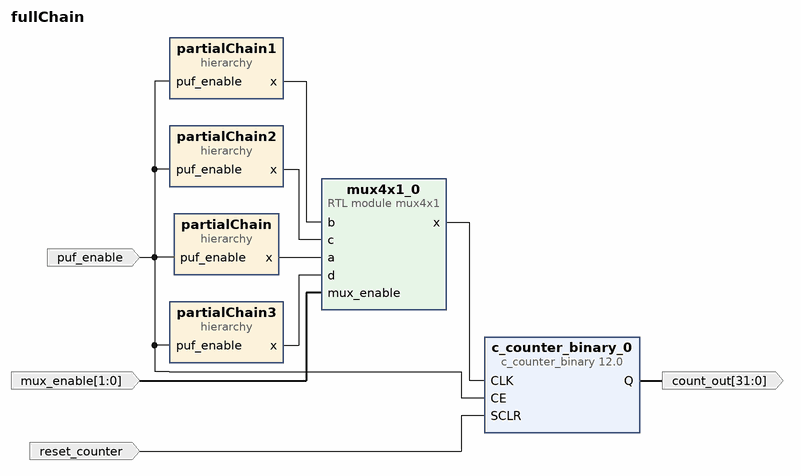
[diagram p0: block diagram of the top level]
# Vivado block design fullChain, xc7z020clg484-1, Vivado 2024.2
create_bd_design fullChain

create_bd_port -dir I puf_enable
create_bd_port -dir O -from 31 -to 0 count_out
create_bd_port -dir I -type data reset_counter
create_bd_port -dir I -from 1 -to 0 mux_enable

create_bd_cell -type hier partialChain
create_bd_cell -type hier partialChain1
create_bd_cell -type hier partialChain2
create_bd_cell -type hier partialChain3
create_bd_cell -type ip -vlnv xilinx.com:ip:c_counter_binary:12.0 c_counter_binary_0
set_property -dict [list \
  CONFIG.CE true \
  CONFIG.Fb_Latency_Configuration Automatic \
  CONFIG.Implementation DSP48 \
  CONFIG.Latency_Configuration Automatic \
  CONFIG.Load false \
  CONFIG.Output_Width 32 \
  CONFIG.Restrict_Count false \
  CONFIG.SCLR true \
] [get_bd_cells c_counter_binary_0]
create_bd_cell -type module -reference mux4x1 mux4x1_0

# ---- hierarchy /partialChain ----
current_bd_instance /partialChain
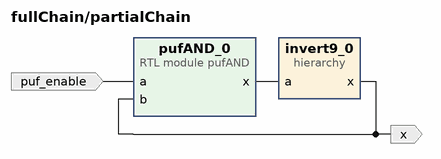
[diagram p1: block diagram inside /partialChain]
create_bd_pin -dir O x
create_bd_pin -dir I puf_enable

create_bd_cell -type hier invert9_0
create_bd_cell -type module -reference pufAND pufAND_0

# ---- hierarchy /partialChain/invert9_0 ----
current_bd_instance /partialChain/invert9_0
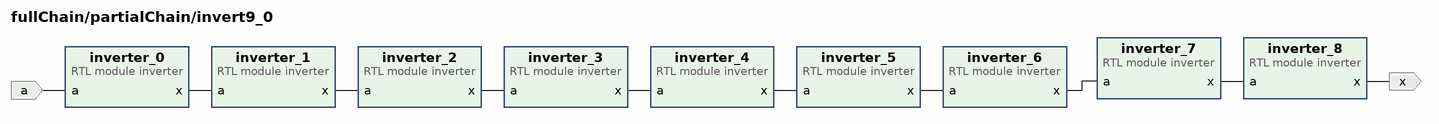
[diagram p2: block diagram inside /partialChain/invert9_0]
create_bd_pin -dir O x
create_bd_pin -dir I a

create_bd_cell -type module -reference inverter inverter_0
create_bd_cell -type module -reference inverter inverter_1
create_bd_cell -type module -reference inverter inverter_2
create_bd_cell -type module -reference inverter inverter_5
create_bd_cell -type module -reference inverter inverter_4
create_bd_cell -type module -reference inverter inverter_3
create_bd_cell -type module -reference inverter inverter_7
create_bd_cell -type module -reference inverter inverter_8
create_bd_cell -type module -reference inverter inverter_6

# ---- hierarchy /partialChain1 ----
current_bd_instance /partialChain1
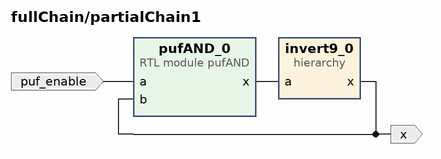
[diagram p3: block diagram inside /partialChain1]
create_bd_pin -dir O x
create_bd_pin -dir I puf_enable

create_bd_cell -type hier invert9_0
create_bd_cell -type module -reference pufAND pufAND_0

# ---- hierarchy /partialChain1/invert9_0 ----
current_bd_instance /partialChain1/invert9_0
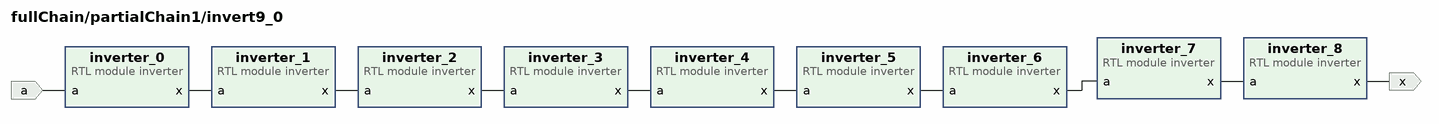
[diagram p4: block diagram inside /partialChain1/invert9_0]
create_bd_pin -dir O x
create_bd_pin -dir I a

create_bd_cell -type module -reference inverter inverter_0
create_bd_cell -type module -reference inverter inverter_1
create_bd_cell -type module -reference inverter inverter_2
create_bd_cell -type module -reference inverter inverter_5
create_bd_cell -type module -reference inverter inverter_4
create_bd_cell -type module -reference inverter inverter_3
create_bd_cell -type module -reference inverter inverter_7
create_bd_cell -type module -reference inverter inverter_8
create_bd_cell -type module -reference inverter inverter_6

# ---- hierarchy /partialChain2 ----
current_bd_instance /partialChain2
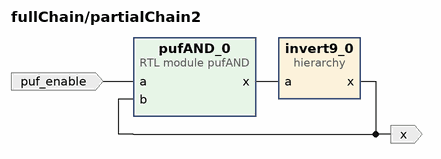
[diagram p5: block diagram inside /partialChain2]
create_bd_pin -dir O x
create_bd_pin -dir I puf_enable

create_bd_cell -type hier invert9_0
create_bd_cell -type module -reference pufAND pufAND_0

# ---- hierarchy /partialChain2/invert9_0 ----
current_bd_instance /partialChain2/invert9_0
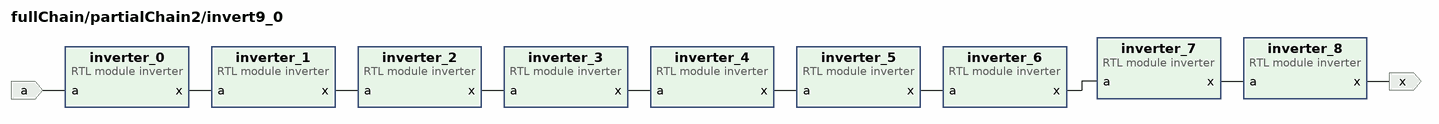
[diagram p6: block diagram inside /partialChain2/invert9_0]
create_bd_pin -dir O x
create_bd_pin -dir I a

create_bd_cell -type module -reference inverter inverter_0
create_bd_cell -type module -reference inverter inverter_1
create_bd_cell -type module -reference inverter inverter_2
create_bd_cell -type module -reference inverter inverter_5
create_bd_cell -type module -reference inverter inverter_4
create_bd_cell -type module -reference inverter inverter_3
create_bd_cell -type module -reference inverter inverter_7
create_bd_cell -type module -reference inverter inverter_8
create_bd_cell -type module -reference inverter inverter_6

# ---- hierarchy /partialChain3 ----
current_bd_instance /partialChain3
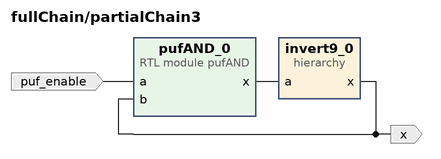
[diagram p7: block diagram inside /partialChain3]
create_bd_pin -dir O x
create_bd_pin -dir I puf_enable

create_bd_cell -type hier invert9_0
create_bd_cell -type module -reference pufAND pufAND_0

# ---- hierarchy /partialChain3/invert9_0 ----
current_bd_instance /partialChain3/invert9_0
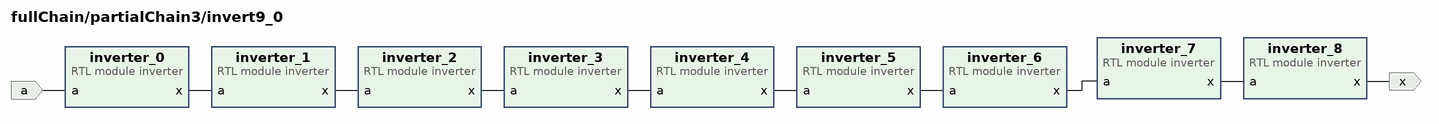
[diagram p8: block diagram inside /partialChain3/invert9_0]
create_bd_pin -dir O x
create_bd_pin -dir I a

create_bd_cell -type module -reference inverter inverter_0
create_bd_cell -type module -reference inverter inverter_1
create_bd_cell -type module -reference inverter inverter_2
create_bd_cell -type module -reference inverter inverter_5
create_bd_cell -type module -reference inverter inverter_4
create_bd_cell -type module -reference inverter inverter_3
create_bd_cell -type module -reference inverter inverter_7
create_bd_cell -type module -reference inverter inverter_8
create_bd_cell -type module -reference inverter inverter_6

# ---- connections ----

current_bd_instance /partialChain
connect_bd_net [get_bd_pins invert9_0/x] [get_bd_pins x] [get_bd_pins pufAND_0/b]
connect_bd_net [get_bd_pins pufAND_0/x] [get_bd_pins invert9_0/a]
connect_bd_net -net puf_CLK_1 [get_bd_pins puf_enable] [get_bd_pins pufAND_0/a]

current_bd_instance /partialChain/invert9_0
connect_bd_net [get_bd_pins a] [get_bd_pins inverter_0/a]
connect_bd_net [get_bd_pins inverter_0/x] [get_bd_pins inverter_1/a]
connect_bd_net -net inverter_2_x [get_bd_pins inverter_8/x] [get_bd_pins x]
connect_bd_net [get_bd_pins inverter_3/x] [get_bd_pins inverter_4/a]
connect_bd_net -net inverter_5_x [get_bd_pins inverter_4/x] [get_bd_pins inverter_5/a]
connect_bd_net -net inverter_6_x [get_bd_pins inverter_2/x] [get_bd_pins inverter_3/a]
connect_bd_net -net inverter_7_x [get_bd_pins inverter_5/x] [get_bd_pins inverter_6/a]
connect_bd_net [get_bd_pins inverter_7/x] [get_bd_pins inverter_8/a]
connect_bd_net -net inverter_8_x [get_bd_pins inverter_6/x] [get_bd_pins inverter_7/a]
connect_bd_net -net inverter_9_x [get_bd_pins inverter_1/x] [get_bd_pins inverter_2/a]

current_bd_instance /partialChain1
connect_bd_net [get_bd_pins invert9_0/x] [get_bd_pins x] [get_bd_pins pufAND_0/b]
connect_bd_net [get_bd_pins pufAND_0/x] [get_bd_pins invert9_0/a]
connect_bd_net -net puf_CLK_1 [get_bd_pins puf_enable] [get_bd_pins pufAND_0/a]

current_bd_instance /partialChain1/invert9_0
connect_bd_net [get_bd_pins a] [get_bd_pins inverter_0/a]
connect_bd_net [get_bd_pins inverter_0/x] [get_bd_pins inverter_1/a]
connect_bd_net -net inverter_2_x [get_bd_pins inverter_8/x] [get_bd_pins x]
connect_bd_net [get_bd_pins inverter_3/x] [get_bd_pins inverter_4/a]
connect_bd_net -net inverter_4_x [get_bd_pins inverter_7/x] [get_bd_pins inverter_8/a]
connect_bd_net -net inverter_5_x [get_bd_pins inverter_4/x] [get_bd_pins inverter_5/a]
connect_bd_net -net inverter_6_x [get_bd_pins inverter_2/x] [get_bd_pins inverter_3/a]
connect_bd_net -net inverter_7_x [get_bd_pins inverter_5/x] [get_bd_pins inverter_6/a]
connect_bd_net -net inverter_8_x [get_bd_pins inverter_6/x] [get_bd_pins inverter_7/a]
connect_bd_net -net inverter_9_x [get_bd_pins inverter_1/x] [get_bd_pins inverter_2/a]

current_bd_instance /partialChain2
connect_bd_net -net a_1 [get_bd_pins pufAND_0/x] [get_bd_pins invert9_0/a]
connect_bd_net [get_bd_pins invert9_0/x] [get_bd_pins x] [get_bd_pins pufAND_0/b]
connect_bd_net -net puf_CLK_1 [get_bd_pins puf_enable] [get_bd_pins pufAND_0/a]

current_bd_instance /partialChain2/invert9_0
connect_bd_net [get_bd_pins a] [get_bd_pins inverter_0/a]
connect_bd_net [get_bd_pins inverter_0/x] [get_bd_pins inverter_1/a]
connect_bd_net -net inverter_2_x [get_bd_pins inverter_8/x] [get_bd_pins x]
connect_bd_net [get_bd_pins inverter_3/x] [get_bd_pins inverter_4/a]
connect_bd_net -net inverter_4_x [get_bd_pins inverter_7/x] [get_bd_pins inverter_8/a]
connect_bd_net -net inverter_5_x [get_bd_pins inverter_4/x] [get_bd_pins inverter_5/a]
connect_bd_net -net inverter_6_x [get_bd_pins inverter_2/x] [get_bd_pins inverter_3/a]
connect_bd_net -net inverter_7_x [get_bd_pins inverter_5/x] [get_bd_pins inverter_6/a]
connect_bd_net -net inverter_8_x [get_bd_pins inverter_6/x] [get_bd_pins inverter_7/a]
connect_bd_net -net inverter_9_x [get_bd_pins inverter_1/x] [get_bd_pins inverter_2/a]

current_bd_instance /partialChain3
connect_bd_net -net a_1 [get_bd_pins pufAND_0/x] [get_bd_pins invert9_0/a]
connect_bd_net [get_bd_pins invert9_0/x] [get_bd_pins x] [get_bd_pins pufAND_0/b]
connect_bd_net -net puf_CLK_1 [get_bd_pins puf_enable] [get_bd_pins pufAND_0/a]

current_bd_instance /partialChain3/invert9_0
connect_bd_net [get_bd_pins a] [get_bd_pins inverter_0/a]
connect_bd_net [get_bd_pins inverter_0/x] [get_bd_pins inverter_1/a]
connect_bd_net -net inverter_2_x [get_bd_pins inverter_8/x] [get_bd_pins x]
connect_bd_net [get_bd_pins inverter_3/x] [get_bd_pins inverter_4/a]
connect_bd_net -net inverter_4_x [get_bd_pins inverter_7/x] [get_bd_pins inverter_8/a]
connect_bd_net -net inverter_5_x [get_bd_pins inverter_4/x] [get_bd_pins inverter_5/a]
connect_bd_net -net inverter_6_x [get_bd_pins inverter_2/x] [get_bd_pins inverter_3/a]
connect_bd_net -net inverter_7_x [get_bd_pins inverter_5/x] [get_bd_pins inverter_6/a]
connect_bd_net -net inverter_8_x [get_bd_pins inverter_6/x] [get_bd_pins inverter_7/a]
connect_bd_net -net inverter_9_x [get_bd_pins inverter_1/x] [get_bd_pins inverter_2/a]

current_bd_instance /
connect_bd_net [get_bd_pins c_counter_binary_0/Q] [get_bd_ports count_out]
connect_bd_net [get_bd_pins mux4x1_0/x] [get_bd_pins c_counter_binary_0/CLK]
connect_bd_net [get_bd_ports mux_enable] [get_bd_pins mux4x1_0/mux_enable]
connect_bd_net [get_bd_pins partialChain1/x] [get_bd_pins mux4x1_0/b]
connect_bd_net [get_bd_pins partialChain2/x] [get_bd_pins mux4x1_0/c]
connect_bd_net [get_bd_pins partialChain3/x] [get_bd_pins mux4x1_0/d]
connect_bd_net [get_bd_pins partialChain/x] [get_bd_pins mux4x1_0/a]
connect_bd_net -net puf_CLK_1 [get_bd_ports puf_enable] \
  [get_bd_pins c_counter_binary_0/CE] [get_bd_pins partialChain/puf_enable] [get_bd_pins partialChain1/puf_enable] \
  [get_bd_pins partialChain2/puf_enable] [get_bd_pins partialChain3/puf_enable]
connect_bd_net [get_bd_ports reset_counter] [get_bd_pins c_counter_binary_0/SCLR]

validate_bd_design
save_bd_design
